# EAGLE design srvg-001 (EAGLE 9.6.2)
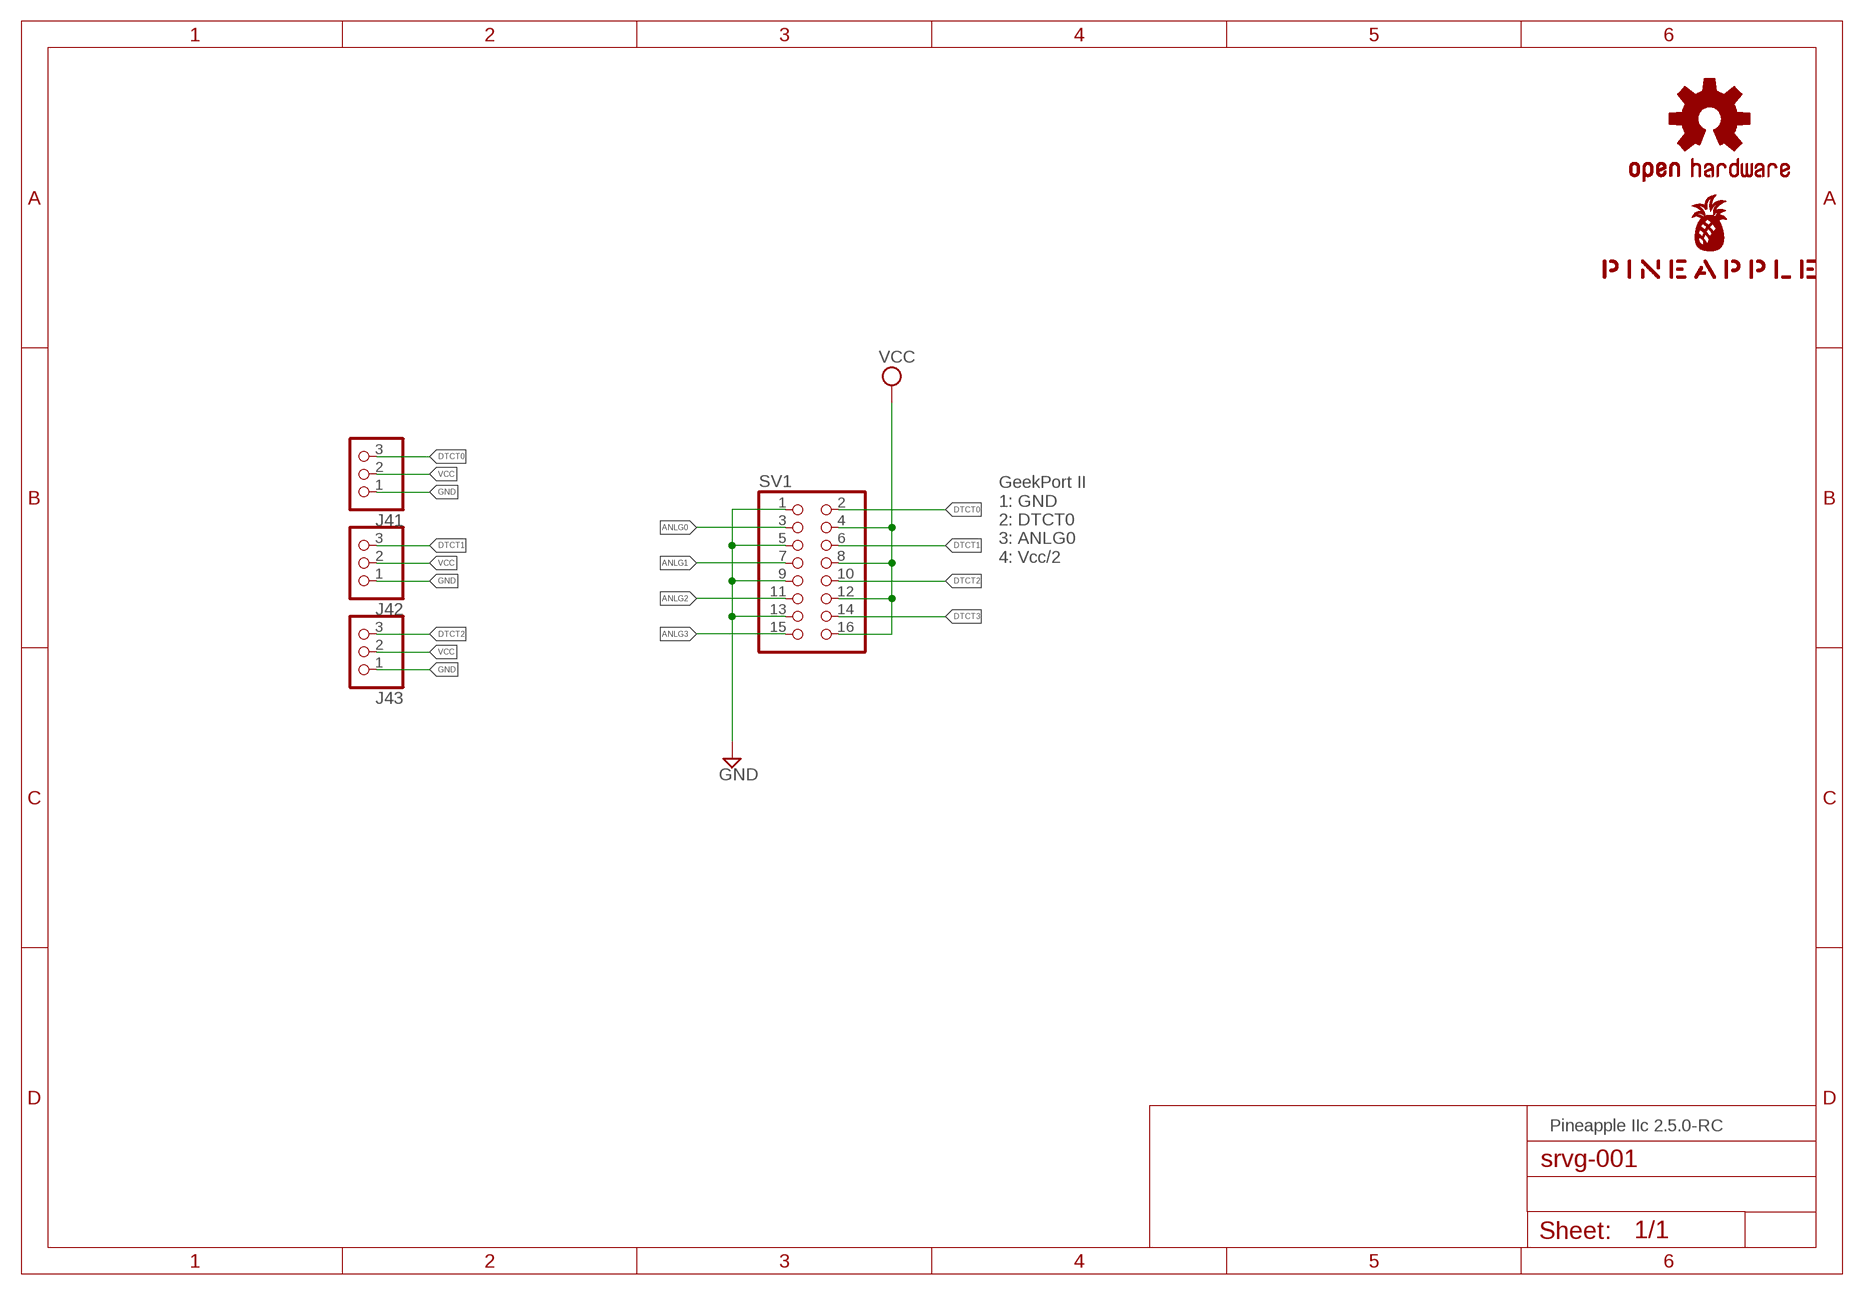
[diagram p0: schematic, sheet 1]

## Parts
J41  PINHD-1X3  [1X03]
J42  PINHD-1X3  [1X03]
J43  PINHD-1X3  [1X03]
LOGO1  OSHW-LOGOS-COPPER  [OSHW-LOGO-S_COPPER]
SV1  PINHD-2X8  [2X08]
U$1  PINEAPPLE450_SILK  [PINEAPPLE450_SILK]

## Nets
ANLG0: SV1.3
ANLG1: SV1.7
ANLG2: SV1.11
ANLG3: SV1.15
DTCT0: J41.3 SV1.2
DTCT1: J42.3 SV1.6
DTCT2: J43.3 SV1.10
DTCT3: SV1.14
GND [ground]: J41.1 J42.1 J43.1 SV1.1 SV1.5 SV1.9 SV1.13
VCC [power1]: J41.2 J42.2 J43.2 SV1.4 SV1.8 SV1.12 SV1.16

## Notes on the sheet
- GeekPort II
  1: GND
  2: DTCT0
  3: ANLG0
  4: Vcc/2
- Pineapple IIc 2.5.0-RC

## Library data of the parts
J41-J43 = pinhead:PINHD-1X3: PIN HEADER
LOGO1 = SparkFun-Aesthetics:OSHW-LOGO: Open-Source Hardware (OSHW) Logo This logo indicates the piece of hardware it is found on incorporates a OSHW license and/or adheres to the definition of open source hardware found here: http://freedomdefined.org/OSHW
SV1 = pinhead:PINHD-2X8: PIN HEADER
U$1 = pineapple:PINEAPPLE450_SILK

## Net classes
0 default: width 0.152 mm, drill 0.152 mm, clearance 0.152 mm
1 ground: width 0.305 mm, drill 0.152 mm, clearance 0.152 mm
2 power1: width 0.508 mm, drill 0.152 mm, clearance 0.152 mm
3 power2: width 0.61 mm, drill 0.152 mm, clearance 0.152 mm
4 analog: width 0.305 mm, drill 0.152 mm, clearance 0.152 mm
5 external: width 0.152 mm, drill 0.152 mm, clearance 0.152 mm

## Board
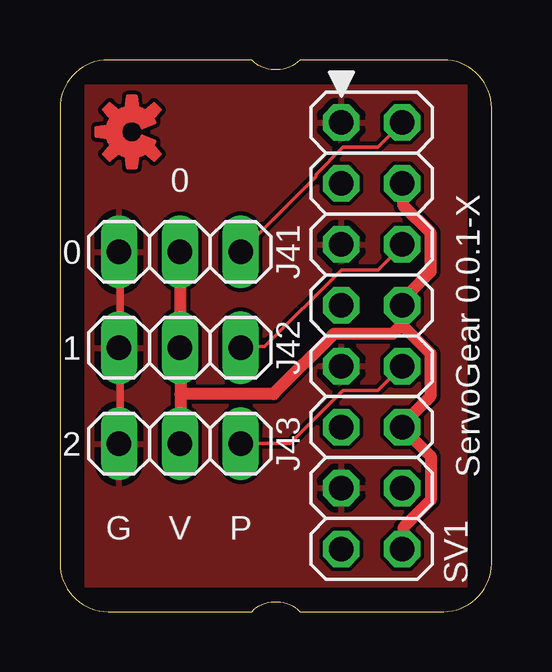
[diagram p1: board, top side]
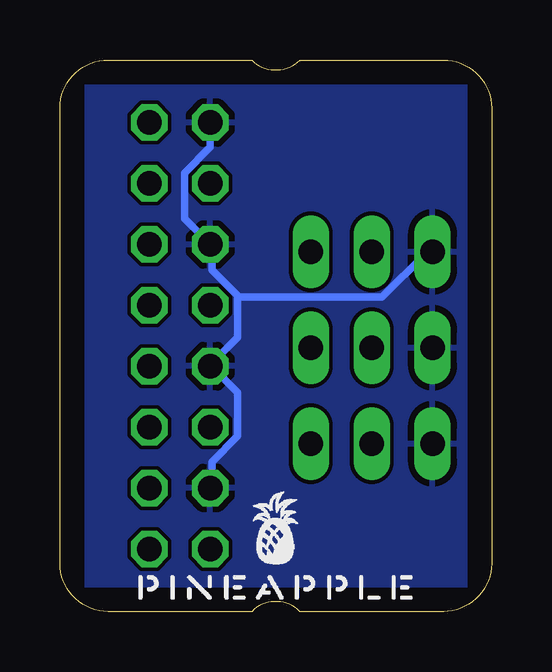
[diagram p2: board, bottom side, seen from below]

Size 18 x 23 mm. Coordinates in mm from the lower left corner, seen from the top.
Outline: 0,21 0,2 arc90 2,0 8,0 arc-90 10,0 16,0 arc90 18,2 18,21 arc90 16,23 10,23 arc-90 8,23 2,23 arc90 0,21
Copper layers (1*16): Top 0.035mm / dielectric 1.5mm / Bottom 0.035mm
Design rules "SeeedStudio_2layer_DRU_no_angle_20140221": minimum track width 6mil, minimum drill 12mil, track to track 6mil, track to pad 6mil, pad to pad 6mil, via to via 6mil, smd to smd 0mil, copper to edge 10mil, drill to drill 10mil, minimum pad ring 10mil, minimum via ring 6mil, stop-mask expansion 2mil, vias tented up to drill 100mil, thermal gap 10mil
tRestrict: area 0,0 to 1,23; area 0,22 to 18,23; area 17,0 to 18,23; area 0,0 to 18,1
bRestrict: area 0,0 to 18,1; area 17,0 to 18,23; area 0,22 to 18,23; area 0,0 to 1,23

### Footprints (pad centres in the part's own frame; a part is rotated, then mirrored left to right if it is on the bottom)
1X03 = drill 1.016 long: 1 -2.54,0; 2 0,0; 3 2.54,0
2X08 = drill 1.016 octagon: 1 -8.89,-1.27; 2 -8.89,1.27; 3 -6.35,-1.27; 4 -6.35,1.27; 5 -3.81,-1.27; 6 -3.81,1.27; 7 -1.27,-1.27; 8 -1.27,1.27; 9 1.27,-1.27; 10 1.27,1.27; 11 3.81,-1.27; 12 3.81,1.27; 13 6.35,-1.27; 14 6.35,1.27; 15 8.89,-1.27; 16 8.89,1.27

### Placement (x,y rotation side)
J41  5,15 0 top
J42  5,11 0 top
J43  5,7 0 top
LOGO1  3,20 90 top
SV1  13,11.5 270 top
U$1  9,0.5 0 bottom

### Tracks (layer width: path | path; a pad name or v marks a point on that pad's centre or on a via)
DTCT0
  Top 0.152: J41.3 10.67,18.14 10.67,18.21 11.81,19.36 13.26,19.36 14.25,20.34 SV1.2
DTCT1
  Top 0.152: J42.3 7.54,11.05 8.53,11.05 11.73,14.25 13.26,14.25 14.25,15.24 SV1.6
DTCT2
  Top 0.152: J43.3 9.6,7.01 11.81,9.22 13.26,9.22 14.25,10.21 SV1.10
GND
  Top 0.305: J43.1 2.52,7.01 2.52,10.97 J42.1 2.52,11.12 2.52,14.94 J41.1
  Bottom 0.305: SV1.13 11.66,5.18 11.66,6.25 10.59,7.32 10.59,9.14 11.66,10.21 SV1.9 11.66,10.36 10.59,11.43 10.59,13.18 | 10.59,13.18 11.66,14.25 11.66,15.24 SV1.5 11.81,15.39 12.8,16.38 12.8,18.29 11.73,19.36 11.73,20.34 SV1.1 | J41.1 2.52,14.94 2.74,14.94 4.57,13.11 10.52,13.11 10.59,13.18
  pour Top: -0.5,-0.5 18.5,-0.5 18.5,23.5 -0.5,23.5
  pour Bottom: -1,-1 19,-1 19,24 -1,24
VCC
  Top 0.508: 5.03,9.07 5.03,10.97 J42.2 5.03,11.2 5.03,14.94 J41.2 | 5.03,9.07 5.03,7.01 J43.2 | SV1.16 14.33,2.67 14.33,3.5 15.47,4.65 15.47,6.48 14.33,7.62 SV1.12 14.4,7.92 15.47,8.99 15.47,10.74 14.33,11.89 | 14.33,11.89 14.33,12.72 SV1.8 14.33,13.03 15.47,14.17 15.47,15.77 14.33,16.92 14.33,17.83 SV1.4 | 5.03,9.07 8.91,9.07 11.43,11.58 13.87,11.58 14.1,11.81 14.33,11.89

### Text on the board
tNames: 0 | 0 | ServoGear 0.0.1-X | 1 | 2 | G | V | P